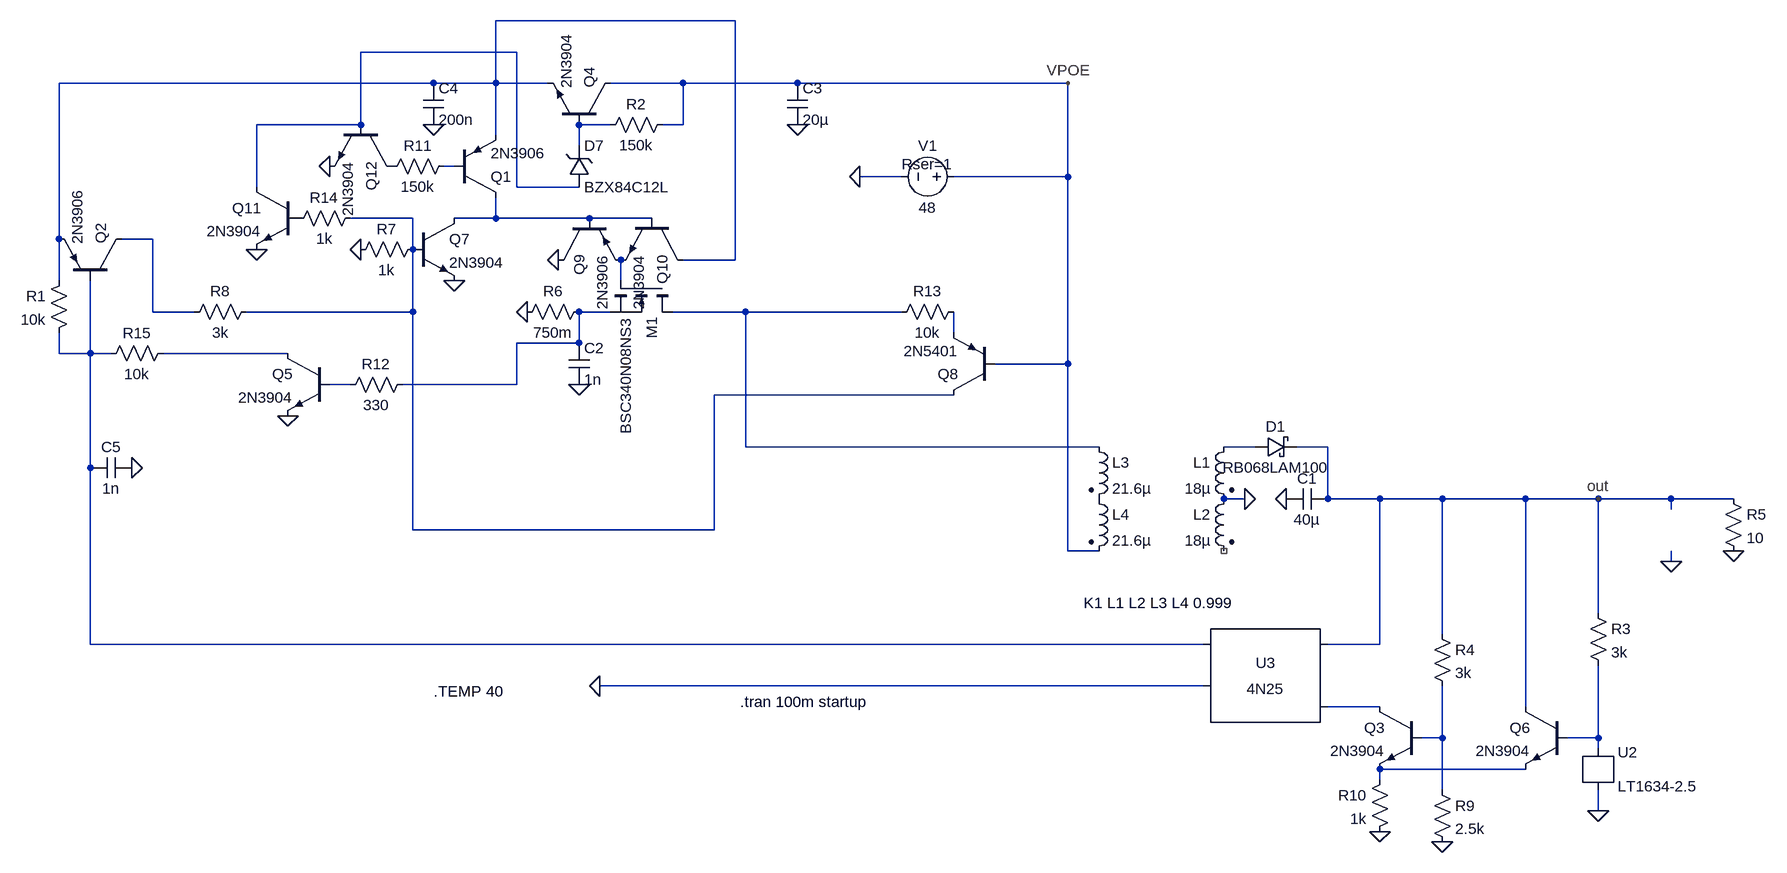
[diagram p0: schematic poe.asc]
poe.asc, the LTspice schematic file:
Version 4
SHEET 1 1312 720
WIRE -368 -608 -736 -608
WIRE -704 -560 -944 -560
WIRE -832 -512 -1408 -512
WIRE -736 -512 -736 -608
WIRE -736 -512 -832 -512
WIRE -656 -512 -736 -512
WIRE -448 -512 -560 -512
WIRE -272 -512 -448 -512
WIRE 144 -512 -272 -512
WIRE -944 -448 -944 -560
WIRE -944 -448 -1104 -448
WIRE -560 -448 -608 -448
WIRE -448 -448 -448 -512
WIRE -448 -448 -480 -448
WIRE -736 -432 -736 -512
WIRE -608 -416 -608 -448
WIRE -800 -384 -816 -384
WIRE -112 -368 -176 -368
WIRE 144 -368 144 -512
WIRE 144 -368 -32 -368
WIRE -1104 -352 -1104 -448
WIRE -704 -352 -704 -560
WIRE -608 -352 -704 -352
WIRE -864 -304 -960 -304
WIRE -736 -304 -736 -336
WIRE -736 -304 -800 -304
WIRE -592 -304 -736 -304
WIRE -496 -304 -592 -304
WIRE -1408 -272 -1408 -512
WIRE -1264 -272 -1312 -272
WIRE -864 -256 -864 -304
WIRE -368 -240 -368 -608
WIRE -368 -240 -448 -240
WIRE -1408 -208 -1408 -272
WIRE -544 -208 -544 -240
WIRE -1264 -160 -1264 -272
WIRE -1200 -160 -1264 -160
WIRE -864 -160 -864 -256
WIRE -864 -160 -1120 -160
WIRE -560 -160 -608 -160
WIRE -352 -160 -464 -160
WIRE -112 -160 -352 -160
WIRE -32 -128 -32 -160
WIRE -608 -112 -608 -160
WIRE -608 -112 -704 -112
WIRE -1408 -96 -1408 -128
WIRE -1360 -96 -1360 -208
WIRE -1360 -96 -1408 -96
WIRE -1328 -96 -1360 -96
WIRE -1056 -96 -1248 -96
WIRE 144 -80 144 -368
WIRE 144 -80 32 -80
WIRE -960 -48 -992 -48
WIRE -704 -48 -704 -112
WIRE -704 -48 -880 -48
WIRE -32 -32 -400 -32
WIRE -352 48 -352 -160
WIRE 192 48 -352 48
WIRE 432 48 384 48
WIRE 544 48 496 48
WIRE -1360 80 -1360 -96
WIRE 416 128 384 128
WIRE 544 128 544 48
WIRE 624 128 544 128
WIRE 720 128 624 128
WIRE 848 128 720 128
WIRE 960 128 848 128
WIRE 1072 128 960 128
WIRE 1168 128 1072 128
WIRE 1072 144 1072 128
WIRE -864 176 -864 -160
WIRE -400 176 -400 -32
WIRE -400 176 -864 176
WIRE 144 208 144 -80
WIRE 192 208 144 208
WIRE 1072 224 1072 208
WIRE 960 304 960 128
WIRE 720 336 720 128
WIRE -1360 352 -1360 80
WIRE 352 352 -1360 352
WIRE 624 352 624 128
WIRE 624 352 544 352
WIRE 352 416 -576 416
WIRE 624 448 544 448
WIRE 848 448 848 128
WIRE 720 496 720 416
WIRE 720 496 688 496
WIRE 960 496 960 384
WIRE 960 496 912 496
WIRE 960 512 960 496
WIRE 848 544 624 544
WIRE 624 560 624 544
WIRE 720 576 720 496
WIRE 960 608 960 576
FLAG 480 128 0
FLAG -176 -368 0
FLAG 144 -512 VPOE
FLAG -272 -448 0
FLAG -688 -160 0
FLAG -1056 0 0
FLAG 960 128 out
FLAG 1168 208 0
FLAG -576 416 0
FLAG -608 -48 0
FLAG 960 608 0
FLAG 720 656 0
FLAG 624 640 0
FLAG -800 -208 0
FLAG -640 -240 0
FLAG 416 128 0
FLAG -832 -448 0
FLAG -944 -256 0
FLAG -992 -384 0
FLAG -1104 -256 0
FLAG 1072 224 0
FLAG -1296 80 0
SYMBOL ind2 400 32 M0
SYMATTR InstName L1
SYMATTR Value 18µ
SYMATTR Type ind
SYMATTR SpiceLine Rser=90m
SYMBOL ind2 400 112 M0
SYMATTR InstName L2
SYMATTR Value 18µ
SYMATTR Type ind
SYMATTR SpiceLine Rser=90m
SYMBOL ind2 176 32 R0
SYMATTR InstName L3
SYMATTR Value 21.6µ
SYMATTR Type ind
SYMATTR SpiceLine Rser=90m
SYMBOL ind2 176 112 R0
SYMATTR InstName L4
SYMATTR Value 21.6µ
SYMATTR Type ind
SYMATTR SpiceLine Rser=90m
SYMBOL cap 544 112 R90
WINDOW 0 0 32 VBottom 2
WINDOW 3 32 32 VTop 2
SYMATTR InstName C1
SYMATTR Value 40µ
SYMBOL voltage -16 -368 R90
WINDOW 0 -32 56 VBottom 2
WINDOW 3 32 56 VTop 2
WINDOW 123 0 0 Left 0
WINDOW 39 -4 56 VBottom 2
SYMATTR InstName V1
SYMATTR Value 48
SYMATTR SpiceLine Rser=1
SYMBOL cap -288 -512 R0
SYMATTR InstName C3
SYMATTR Value 20µ
SYMBOL res -464 -464 R90
WINDOW 0 0 56 VBottom 2
WINDOW 3 32 56 VTop 2
SYMATTR InstName R2
SYMATTR Value 150k
SYMBOL nmos -464 -208 R90
SYMATTR InstName M1
SYMATTR Value BSC340N08NS3
SYMBOL zener -624 -352 M180
WINDOW 0 24 64 Left 2
WINDOW 3 24 0 Left 2
SYMATTR InstName D7
SYMATTR Value BZX84C12L
SYMATTR Description Diode
SYMATTR Type diode
SYMBOL res -592 -176 R90
WINDOW 0 0 56 VBottom 2
WINDOW 3 32 56 VTop 2
SYMATTR InstName R6
SYMATTR Value 750m
SYMBOL npn -992 -96 M0
SYMATTR InstName Q5
SYMATTR Value 2N3904
SYMBOL res 1152 112 R0
SYMATTR InstName R5
SYMATTR Value 10
SYMBOL pnp -1312 -208 M270
SYMATTR InstName Q2
SYMATTR Value 2N3906
SYMBOL res -1392 -224 M0
SYMATTR InstName R1
SYMATTR Value 10k
SYMBOL cap -624 -112 R0
SYMATTR InstName C2
SYMATTR Value 1n
SYMBOL npn -560 -448 M270
SYMATTR InstName Q4
SYMATTR Value 2N3904
SYMBOL npn 688 448 M0
SYMATTR InstName Q3
SYMATTR Value 2N3904
SYMBOL npn 912 448 M0
SYMATTR InstName Q6
SYMATTR Value 2N3904
SYMBOL res 944 288 R0
SYMATTR InstName R3
SYMATTR Value 3k
SYMBOL res 704 320 R0
SYMATTR InstName R4
SYMATTR Value 3k
SYMBOL res 704 560 R0
SYMATTR InstName R9
SYMATTR Value 2.5k
SYMBOL res 640 544 M0
SYMATTR InstName R10
SYMATTR Value 1k
SYMBOL npn -864 -304 R0
SYMATTR InstName Q7
SYMATTR Value 2N3904
SYMBOL pnp -640 -304 M90
SYMATTR InstName Q9
SYMATTR Value 2N3906
SYMBOL npn -448 -304 R90
SYMATTR InstName Q10
SYMATTR Value 2N3904
SYMBOL res -864 -64 R90
WINDOW 0 0 56 VBottom 2
WINDOW 3 32 56 VTop 2
SYMATTR InstName R12
SYMATTR Value 330
SYMBOL pnp 32 -32 R180
SYMATTR InstName Q8
SYMATTR Value 2N5401
SYMBOL res -16 -176 R90
WINDOW 0 0 56 VBottom 2
WINDOW 3 32 56 VTop 2
SYMATTR InstName R13
SYMATTR Value 10k
SYMBOL schottky 432 64 R270
WINDOW 0 32 32 VTop 2
WINDOW 3 0 32 VBottom 2
SYMATTR InstName D1
SYMATTR Value RB068LAM100
SYMATTR Description Diode
SYMATTR Type diode
SYMBOL cap -848 -512 R0
SYMATTR InstName C4
SYMATTR Value 200n
SYMBOL res -848 -272 R90
WINDOW 0 0 56 VBottom 2
WINDOW 3 32 56 VTop 2
SYMATTR InstName R7
SYMATTR Value 1k
SYMBOL pnp -800 -336 M180
SYMATTR InstName Q1
SYMATTR Value 2N3906
SYMBOL res -800 -400 R90
WINDOW 0 0 56 VBottom 2
WINDOW 3 32 56 VTop 2
SYMATTR InstName R11
SYMATTR Value 150k
SYMBOL res -1232 -112 R90
WINDOW 0 0 56 VBottom 2
WINDOW 3 32 56 VTop 2
SYMATTR InstName R15
SYMATTR Value 10k
SYMBOL npn -896 -448 R90
SYMATTR InstName Q12
SYMATTR Value 2N3904
SYMBOL npn -1040 -352 M0
SYMATTR InstName Q11
SYMATTR Value 2N3904
SYMBOL res -944 -320 R90
WINDOW 0 0 56 VBottom 2
WINDOW 3 32 56 VTop 2
SYMATTR InstName R14
SYMATTR Value 1k
SYMBOL References\\LT1634-2.5 960 544 R0
SYMATTR InstName U2
SYMBOL Optos\\4N25 448 416 M0
SYMATTR InstName U3
SYMBOL res -1104 -176 R90
WINDOW 0 0 56 VBottom 2
WINDOW 3 32 56 VTop 2
SYMATTR InstName R8
SYMATTR Value 3k
SYMBOL cap -1296 64 R90
WINDOW 0 0 32 VBottom 2
WINDOW 3 32 32 VTop 2
SYMATTR InstName C5
SYMATTR Value 1n
TEXT -360 440 Left 2 !.tran 100m startup
TEXT 168 288 Left 2 !K1 L1 L2 L3 L4 0.999
TEXT -832 424 Left 2 !.TEMP 40

The netlist it stands for:
* poe.asc
L1 N015 0 18µ Rser=90m
L2 0 NC_01 18µ Rser=90m
L3 N010 P001 21.6µ Rser=90m
L4 P001 VPOE 21.6µ Rser=90m
C1 out 0 40µ
V1 VPOE 0 48 Rser=1
C3 VPOE 0 20µ
R2 VPOE N003 150k
M1 N010 N008 N009 N009 BSC340N08NS3
D7 N002 N003 BZX84C12L
R6 N009 0 750m
Q5 N013 N014 0 0 2N3904
R5 out 0 10
Q2 N007 N012 N001 0 2N3906
R1 N001 N012 10k
C2 N009 0 1n
Q4 VPOE N003 N001 0 2N3904
Q3 N016 N017 N019 0 2N3904
Q6 out N018 N019 0 2N3904
R3 out N018 3k
R4 out N017 3k
R9 N017 0 2.5k
R10 N019 0 1k
Q7 N006 N005 0 0 2N3904
Q9 0 N006 N008 0 2N3906
Q10 N001 N006 N008 0 2N3904
R12 N009 N014 330
Q8 N005 VPOE N011 0 2N5401
R13 N011 N010 10k
D1 N015 out RB068LAM100
C4 N001 0 200n
R7 N005 0 1k
Q1 N006 N004 N001 0 2N3906
R11 N004 P002 150k
R15 N013 N012 10k
Q12 P002 N002 0 0 2N3904
Q11 N002 P003 0 0 2N3904
R14 N005 P003 1k
XU2 N018 0 LT1634-2.5
XU3 out N016 N012 0 NC_02 4N25
R8 N005 N007 3k
C5 0 N012 1n
.model D D
.lib standard.dio
.model NPN NPN
.model PNP PNP
.lib standard.bjt
.model NMOS NMOS
.model PMOS PMOS
.lib standard.mos
.tran 100m startup
K1 L1 L2 L3 L4 0.999
.TEMP 40
.lib 4N25.sub
.backanno
.end